# Altium schematic sheet CTRL_LOGIC.SchDoc: CPLD logic
size 420 x 297 mm; Author: G.K.; CompanyName: WUT; DrawnBy: G.K.; Organization: WUT ISE; Address1: Warsaw Univeristy of Technology; Address2: Nowowiejska 15/19; DocumentNumber: 7; Revision: -; SheetNumber: 7; SheetTotal: 7; EDA_Number: ARTIQ; Projet: ARTIQ/SINARA; ModifiedBy: -; CreateDate: XX/XX/XXXX; CheckedDate: -; Title2: & option switches; DivGrp: ISE; Designer: G.K.; ModifiedDate: -; ProjectName: ARTIQ/SINARA
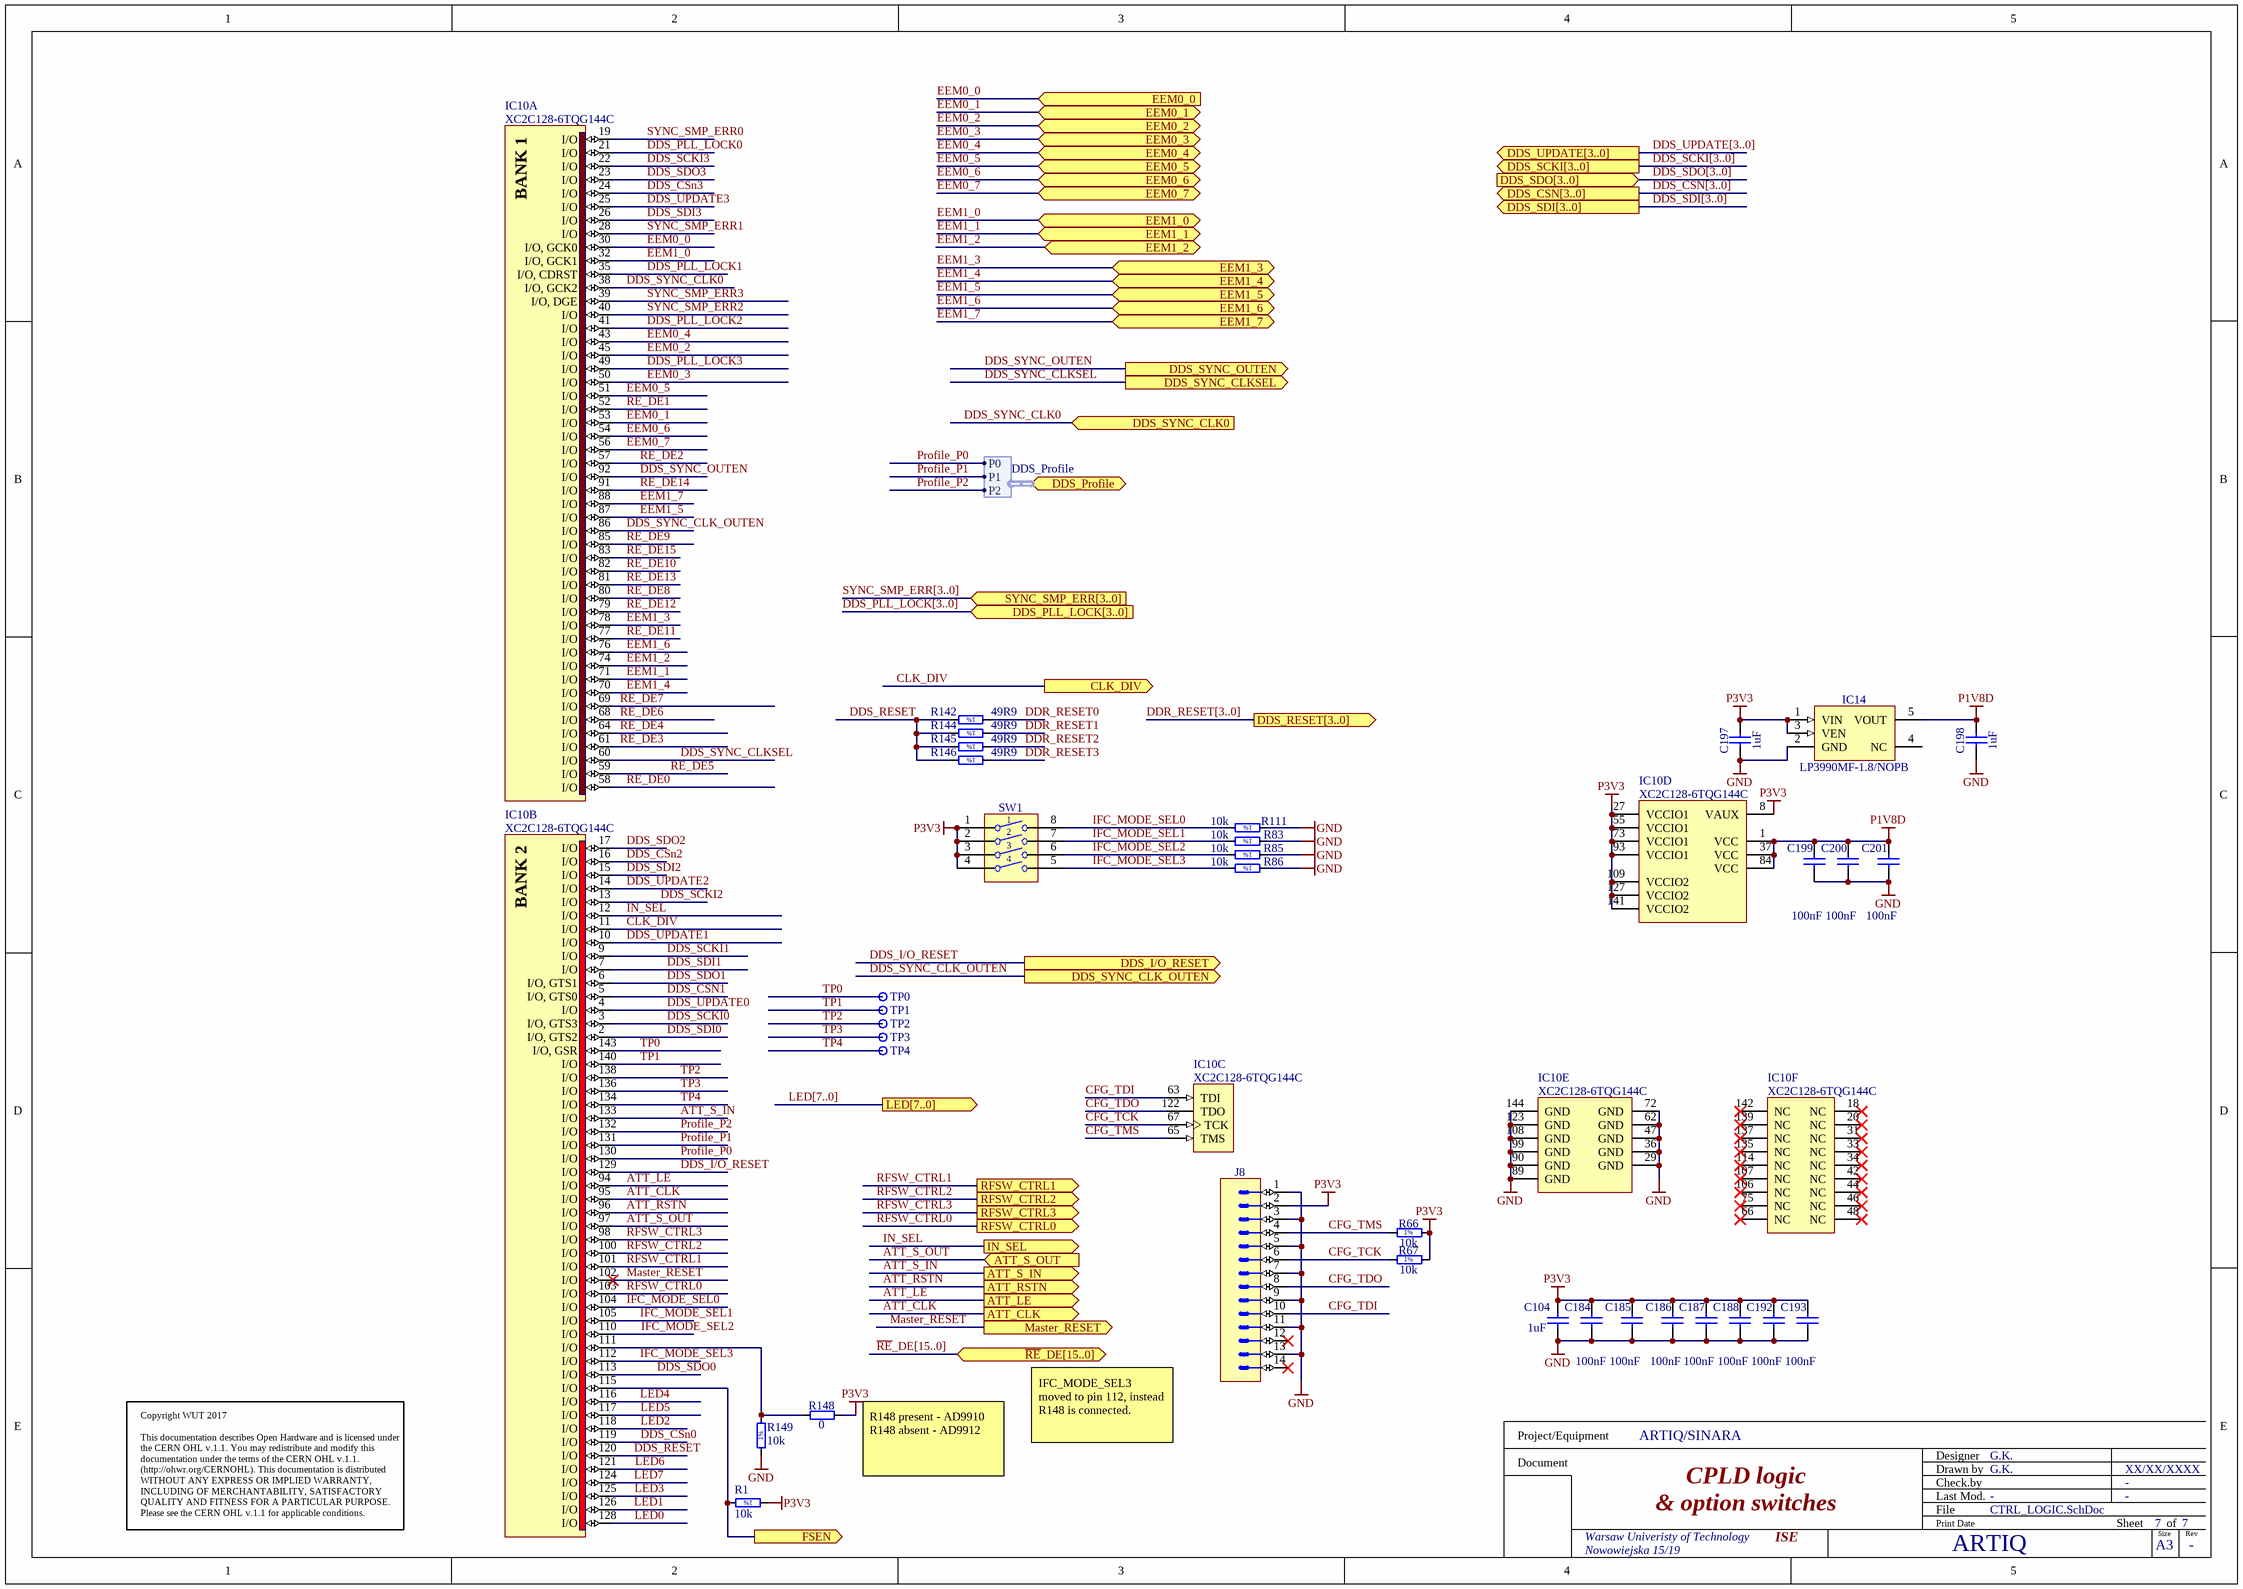
[diagram p0: CTRL_LOGIC.SchDoc]

## Parts
C104  1uF  [CAPC1005X55N]
C184  100nF  [CAPC1005X55N]
C185  100nF  [CAPC1005X55N]
C186  100nF  [CAPC1005X55N]
C187  100nF  [CAPC1005X55N]
C188  100nF  [CAPC1005X55N]
C192  100nF  [CAPC1005X55N]
C193  100nF  [CAPC1005X55N]
C197  1uF  [CAPC1005X55N]
C198  1uF  [CAPC1005X55N]
C199  100nF  [CAPC1005X55N]
C200  100nF  [CAPC1005X55N]
C201  100nF  [CAPC1005X55N]
IC10  XC2C128-6TQG144C  [QFP50P2200X2200X160-144N]  (parts A,B,C,D,E,F of 6)
IC14  LP3990MF-1.8/NOPB  [SOT95P284X122-5N]
J8  Milli-Grid™  [MOLEX_87832-1420]  (value not drawn)
R1  10k  [RESC1005X40N]
R66  10k  [RESC1005X40N]
R67  10k  [RESC1005X40N]
R83  10k  [RESC1005X40N]
R85  10k  [RESC1005X40N]
R86  10k  [RESC1005X40N]
R111  10k  [RESC1005X40N]
R142  49R9  [RESC1005X40N]
R144  49R9  [RESC1005X40N]
R145  49R9  [RESC1005X40N]
R146  49R9  [RESC1005X40N]
R148  0  [RESC1005X40N]
R149  10k  [RESC1005X40N]
SW1  Switch  [SW_OMRON_A6S-4102-H]  (value not drawn)
TP0  Test Point  [TPS127]  (value not drawn)
TP1  Test Point  [TPS127]  (value not drawn)
TP2  Test Point  [TPS127]  (value not drawn)
TP3  Test Point  [TPS127]  (value not drawn)
TP4  Test Point  [TPS127]  (value not drawn)

## Ports
ATT_CLK (out), ATT_LE (out), ATT_RSTN (out), ATT_S_IN (out), ATT_S_OUT (in), CLK_DIV (out), DDS_CSN[3..0] (out), DDS_I/O_RESET (out), DDS_PLL_LOCK[3..0] (in), DDS_Profile (harness DDS_Profile), DDS_RESET[3..0] (out), DDS_SCKI[3..0] (out), DDS_SDI[3..0] (out), DDS_SDO[3..0] (in), DDS_SYNC_CLK0 (in), DDS_SYNC_CLK_OUTEN (out), DDS_SYNC_CLKSEL (out), DDS_SYNC_OUTEN (out), DDS_UPDATE[3..0] (out), EEM0_0 (in), EEM0_1 (bidir), EEM0_2 (bidir), EEM0_3 (bidir), EEM0_4 (bidir), EEM0_5 (bidir), EEM0_6 (bidir), EEM0_7 (bidir), EEM1_0 (bidir), EEM1_1 (bidir), EEM1_2 (bidir), EEM1_3 (bidir), EEM1_4 (bidir), EEM1_5 (bidir), EEM1_6 (bidir), EEM1_7 (bidir), FSEN (out), IN_SEL (out), LED[7..0] (out), Master_RESET (out), RFSW_CTRL0 (out), RFSW_CTRL1 (out), RFSW_CTRL2 (out), RFSW_CTRL3 (out), SYNC_SMP_ERR[3..0] (in), ~{RE}_DE[15..0] (bidir)

## Harnesses
DDS_Profile: P0, P1, P2

## Nets
GND: C104.1 C184.1 C185.1 C186.1 C187.1 C188.1 C192.1 C193.1 C197.1 C198.1 C199.1 C200.1 C201.1 IC10.29(GND) IC10.36(GND) IC10.47(GND) IC10.62(GND) IC10.72(GND) IC10.89(GND) IC10.90(GND) IC10.99(GND) IC10.108(GND) IC10.123(GND) IC10.144(GND) IC14.2(GND) J8.1 J8.3 J8.5 J8.7 J8.9 J8.11 J8.13 R83.1 R85.1 R86.1 R111.1 R149.1
P1V8D: C198.2 C199.2 C200.2 C201.2 IC10.1(VCC) IC10.37(VCC) IC10.84(VCC) IC14.5(VOUT)
P3V3: C104.2 C184.2 C185.2 C186.2 C187.2 C188.2 C192.2 C193.2 C197.2 IC10.8(VAUX) IC10.27(VCCIO1) IC10.55(VCCIO1) IC10.73(VCCIO1) IC10.93(VCCIO1) IC10.109(VCCIO2) IC10.127(VCCIO2) IC10.141(VCCIO2) IC14.1(VIN) IC14.3(VEN) J8.2 R1.1 R66.2 R67.2 R148.2 SW1.1 SW1.2 SW1.3 SW1.4
ATT_CLK: IC10.95(I/O) ; port ATT_CLK
ATT_LE: IC10.94(I/O) ; port ATT_LE
ATT_RSTN: IC10.96(I/O) ; port ATT_RSTN
ATT_S_IN: IC10.133(I/O) ; port ATT_S_IN
ATT_S_OUT: IC10.97(I/O) ; port ATT_S_OUT
CFG_TCK: IC10.67(TCK) J8.6 R67.1
CFG_TDI: IC10.63(TDI) J8.10
CFG_TDO: IC10.122(TDO) J8.8
CFG_TMS: IC10.65(TMS) J8.4 R66.1
CLK_DIV: IC10.11(I/O) ; port CLK_DIV
DDR_RESET0: R142.1
DDR_RESET1: R144.1
DDR_RESET2: R145.1
DDR_RESET3: R146.1
DDS_CSn0: IC10.119(I/O)
DDS_CSN1: IC10.5(I/O,_GTS0)
DDS_CSn2: IC10.16(I/O)
DDS_CSn3: IC10.24(I/O)
DDS_I/O_RESET: IC10.129(I/O) ; port DDS_I/O_RESET
DDS_PLL_LOCK0: IC10.21(I/O)
DDS_PLL_LOCK1: IC10.35(I/O,_CDRST)
DDS_PLL_LOCK2: IC10.41(I/O)
DDS_PLL_LOCK3: IC10.49(I/O)
DDS_RESET: IC10.120(I/O) R142.2 R144.2 R145.2 R146.2
DDS_SCKI0: IC10.3(I/O,_GTS3)
DDS_SCKI1: IC10.9(I/O)
DDS_SCKI2: IC10.13(I/O)
DDS_SCKI3: IC10.22(I/O)
DDS_SDI0: IC10.2(I/O,_GTS2)
DDS_SDI1: IC10.7(I/O)
DDS_SDI2: IC10.15(I/O)
DDS_SDI3: IC10.26(I/O)
DDS_SDO0: IC10.113(I/O)
DDS_SDO1: IC10.6(I/O,_GTS1)
DDS_SDO2: IC10.17(I/O)
DDS_SDO3: IC10.23(I/O)
DDS_SYNC_CLK0: IC10.38(I/O,_GCK2) ; port DDS_SYNC_CLK0
DDS_SYNC_CLK_OUTEN: IC10.86(I/O) ; port DDS_SYNC_CLK_OUTEN
DDS_SYNC_CLKSEL: IC10.60(I/O) ; port DDS_SYNC_CLKSEL
DDS_SYNC_OUTEN: IC10.92(I/O) ; port DDS_SYNC_OUTEN
DDS_UPDATE0: IC10.4(I/O)
DDS_UPDATE1: IC10.10(I/O)
DDS_UPDATE2: IC10.14(I/O)
DDS_UPDATE3: IC10.25(I/O)
EEM0_0: IC10.30(I/O,_GCK0) ; port EEM0_0
EEM0_1: IC10.53(I/O) ; port EEM0_1
EEM0_2: IC10.45(I/O) ; port EEM0_2
EEM0_3: IC10.50(I/O) ; port EEM0_3
EEM0_4: IC10.43(I/O) ; port EEM0_4
EEM0_5: IC10.51(I/O) ; port EEM0_5
EEM0_6: IC10.54(I/O) ; port EEM0_6
EEM0_7: IC10.56(I/O) ; port EEM0_7
EEM1_0: IC10.32(I/O,_GCK1) ; port EEM1_0
EEM1_1: IC10.71(I/O) ; port EEM1_1
EEM1_2: IC10.74(I/O) ; port EEM1_2
EEM1_3: IC10.78(I/O) ; port EEM1_3
EEM1_4: IC10.70(I/O) ; port EEM1_4
EEM1_5: IC10.87(I/O) ; port EEM1_5
EEM1_6: IC10.76(I/O) ; port EEM1_6
EEM1_7: IC10.88(I/O) ; port EEM1_7
FSEN: IC10.115(I/O) R1.2 ; port FSEN
IFC_MODE_SEL0: IC10.104(I/O) R111.2 SW1.8
IFC_MODE_SEL1: IC10.105(I/O) R83.2 SW1.7
IFC_MODE_SEL2: IC10.110(I/O) R85.2 SW1.6
IFC_MODE_SEL3: IC10.112(I/O) R86.2 SW1.5
IN_SEL: IC10.12(I/O) ; port IN_SEL
LED0: IC10.128(I/O)
LED1: IC10.126(I/O)
LED2: IC10.118(I/O)
LED3: IC10.125(I/O)
LED4: IC10.116(I/O)
LED5: IC10.117(I/O)
LED6: IC10.121(I/O)
LED7: IC10.124(I/O)
Master_RESET: IC10.102(I/O) ; port Master_RESET
Profile_P0: IC10.130(I/O) ; port DDS_Profile.P0
Profile_P1: IC10.131(I/O) ; port DDS_Profile.P1
Profile_P2: IC10.132(I/O) ; port DDS_Profile.P2
~{RE}_DE0: IC10.58(I/O)
~{RE}_DE1: IC10.52(I/O)
~{RE}_DE2: IC10.57(I/O)
~{RE}_DE3: IC10.61(I/O)
~{RE}_DE4: IC10.64(I/O)
~{RE}_DE5: IC10.59(I/O)
~{RE}_DE6: IC10.68(I/O)
~{RE}_DE7: IC10.69(I/O)
~{RE}_DE8: IC10.80(I/O)
~{RE}_DE9: IC10.85(I/O)
~{RE}_DE10: IC10.82(I/O)
~{RE}_DE11: IC10.77(I/O)
~{RE}_DE12: IC10.79(I/O)
~{RE}_DE13: IC10.81(I/O)
~{RE}_DE14: IC10.91(I/O)
~{RE}_DE15: IC10.83(I/O)
RFSW_CTRL0: IC10.103(I/O) ; port RFSW_CTRL0
RFSW_CTRL1: IC10.101(I/O) ; port RFSW_CTRL1
RFSW_CTRL2: IC10.100(I/O) ; port RFSW_CTRL2
RFSW_CTRL3: IC10.98(I/O) ; port RFSW_CTRL3
SYNC_SMP_ERR0: IC10.19(I/O)
SYNC_SMP_ERR1: IC10.28(I/O)
SYNC_SMP_ERR2: IC10.40(I/O)
SYNC_SMP_ERR3: IC10.39(I/O,_DGE)
TP0: IC10.143(I/O,_GSR) TP0.1
TP1: IC10.140(I/O) TP1.1
TP2: IC10.138(I/O) TP2.1
TP3: IC10.136(I/O) TP3.1
TP4: IC10.134(I/O) TP4.1
NetIC10_111: IC10.111(I/O) R148.1 R149.2

Not connected (* = marked no-connect by the designer): IC10 18(NC)* 20(NC)* 31(NC)* 33(NC)* 34(NC)* 42(NC)* 44(NC)* 46(NC)* 48(NC)* 66(NC)* 75(NC)* 106(NC)* 107(NC)* 114(NC)* 135(NC)* 137(NC)* 139(NC)* 142(NC)*; IC14 4(NC); J8 12* 14*

## Buses and harness runs
bus DDR_RESET[3..0] = port DDS_RESET[3..0]
bus DDS_CSN[3..0] = port DDS_CSN[3..0]
bus DDS_PLL_LOCK[3..0] = port DDS_PLL_LOCK[3..0]
bus DDS_SCKI[3..0] = port DDS_SCKI[3..0]
bus DDS_SDI[3..0] = port DDS_SDI[3..0]
bus DDS_SDO[3..0] = port DDS_SDO[3..0]
bus DDS_UPDATE[3..0] = port DDS_UPDATE[3..0]
bus LED[7..0] = port LED[7..0]
bus SYNC_SMP_ERR[3..0] = port SYNC_SMP_ERR[3..0]
bus ~{RE}_DE[15..0] = port ~{RE}_DE[15..0]

## Notes on the sheet
- (near R148) R148 present - AD9910
  R148 absent - AD9912
- IFC_MODE_SEL3 moved to pin 112, instead R148 is connected.
- Copyright WUT 2017
  This documentation describes Open Hardware and is licensed under the CERN OHL v.1.1. You may redistribute and modify this documentation under the terms of the CERN OHL v.1.1. (http://ohwr.org/CERNOHL). This documentation is distributed WITHOUT ANY EXPRESS OR IMPLIED WARRANTY, INCLUDING OF MERCHANTABILITY, SATISFACTORY QUALITY AND FITNESS FOR A PARTICULAR PURPOSE. Please see the CERN OHL v.1.1 for applicable conditions.
- Project/Equipment
- Document
- Designer
- Drawn by
- Check.by
- File
- Last Mod.
- Print Date
- Sheet
- Size
- A3
- of
- Rev
- (in symbol R0402_10K_1%_0.0625W_100PPM) 1%
- (in symbol R0402_49R9_1%_0.0625W_100PPM) 1%
- (in symbol XC2C128-6TQG144C, part A) BANK 1
- (in symbol XC2C128-6TQG144C, part B) BANK 2

## Library data of the parts
C104 C197 C198 = CC0402_1UF_16V_10%_X5R: Non-polarised capacitor; Part Description: SMD Multilayer Chip Ceramic Capacitor; Manufacturer: GENERIC; Manufacturer1 Part Number: C1005X5R1C105KT; Voltage: 16V; TC: X5R; Tolerance: ±10%; Part Number: CC0402_1UF_16V_10%_X5R; Component Kind: Standard; Component Type: Standard; Pin Count: 2; Value: 1uF; Status: Preferred; Manufacturer Part Number: CC0402_1UF_16V_10%_X5R; Case: 0402; Mounted: Yes; Socket: No; SMD: Yes; Sense: No; Manufacturer1 Example: TDK; Manufacturer1 ComponentHeight: 0.55mm; HelpURL: \\cern.ch\dfs\Applications\Altium\Datasheets\CC0402_X5R_TDK_C.pdf; Author: CERN DEM JLC; CreateDate: 2012-10-25; LatestRevisionDate: 2012-10-25
C184-C188 C192 C193 C199-C201 = CC0402_100NF_16V_10%_X5R: Non-polarised capacitor; Part Description: SMD Multilayer Chip Ceramic Capacitor; Manufacturer: GENERIC; Manufacturer1 Part Number: GRM155R61C104KA88D; Voltage: 16V; TC: X5R; Tolerance: ±10%; Part Number: CC0402_100NF_16V_10%_X5R; Component Kind: Standard; Component Type: Standard; Pin Count: 2; Value: 100nF; Status: None; Manufacturer Part Number: CC0402_100NF_16V_10%_X5R; Case: 0402; Mounted: Yes; Socket: No; SMD: Yes; Sense: No; Manufacturer1 Example: MURATA; Manufacturer1 ComponentHeight: 0.55mm; HelpURL: \\cern.ch\dfs\Applications\Altium\Datasheets\CC0402_X5R_MURATA_GRM.pdf; Author: CERN DEM JLC; CreateDate: 10.12.2013; LatestRevisionDate: 10.12.2013
IC10 = XC2C128-6TQG144C: CoolRunner-II 1.8V, 128 Macrocell CPLD, 100 User I/Os, 144-Pin TQFP, Commercial Grade, Pb-Free; Manufacturer: XILINX; PressFit: No; Bonding: No; Part Number: XC2C128-6TQG144C; Component Kind: Standard; Component Type: Standard; Device: XC2C128-6TQG144C; PackageDescription: QFP, 144-Leads, Body 20x20mm (BSC), Pitch 0.50mm, IPC Medium Density; Part Description: CoolRunner-II 1.8V, 128 Macrocell CPLD, 100 User I/Os, 144-Pin TQFP, Commercial Grade, Pb-Free; Manufacturer Part Number: XC2C128-6TQG144C; Pin Count: 144; Case: QFP144; Mounted: Yes; Socket: No; SMD: Yes; Sense: No; ComponentHeight: 1.6mm; HelpURL: \\cern.ch\dfs\Applications\Altium\Datasheets\XC2C128-6TQG144C.pdf; ComponentLink1URL: \\cern.ch\dfs\Applications\Altium\Datasheets\XC2C128-6TQG144C_Package.pdf; ComponentLink1Description: Package Drawing; Author: CERN DEM JLC; CreateDate: 16.11.2010; LatestRevisionDate: 16.11.2010
IC14 = LP3990MF-1.8/NOPB: 1.8V, 150mA Linear Voltage Regulator For Digital Applications; Manufacturer: TEXAS INSTRUMENTS; PressFit: No; Bonding: No; Part Number: LP3990MF-1.8/NOPB; Component Kind: Standard; Component Type: Standard; Device: LP3990MF-1.8/NOPB; PackageDescription: SOT23 5, Pitch 0.95mm - Body 1.67x2.99mm, IPC Medium Density; Part Description: 1.8V, 150mA Linear Voltage Regulator For Digital Applications; Manufacturer Part Number: LP3990MF-1.8/NOPB; Pin Count: 5; Case: SOT23-5; Mounted: Yes; Socket: No; SMD: Yes; Sense: No; ComponentHeight: 1.19mm; HelpURL: \\cern.ch\dfs\Applications\Altium\Datasheets\LP3990MF-1.8-NOPB.pdf; Author: CERN DEM JLC; CreateDate: 19.01.2011; LatestRevisionDate: 16.09.2014
J8 = MOLEX_87832-1420: Connector 14 Male; Part Description: 2.00mm (.079") Pitch Milli-Grid™ Header, Surface Mount, Vertical, Shrouded, 14 Circuits,with Locking Windows and Centre Polarization Slot, PCB Locator; Manufacturer: MOLEX; PressFit: No; Part Number: MOLEX_87832-1420; Component Kind: Standard; Component Type: Standard; Pin Count: 14; Family: Milli-Grid™; Mounted: Yes; Socket: No; SMD: Yes; Sense: No; Status: None; Manufacturer Part Number: 87832-1420; ComponentHeight: 7.6mm; HelpURL: \\cern.ch\dfs\Applications\Altium\Datasheets\MOLEX_87832-1420.pdf; Author: CERN DEM JLC; CreateDate: 09.09.2008; LatestRevisionDate: 09.09.2008
R1 R66 R67 R83 R85 R86 R111 R149 = R0402_10K_1%_0.0625W_100PPM: Resistor - 1%; Part Description: General Purpose Thick Film Chip Resistor; Manufacturer: GENERIC; Manufacturer1 Part Number: 232270671003L; TC: ±100ppm/°C; Part Number: R0402_10K_1%_0.0625W_100PPM; Component Kind: Standard; Component Type: Standard; Pin Count: 2; Value: 10k; Status: Not recommended; Power: 0.0625W; Tolerance: ±1%; Manufacturer Part Number: R0402_10K_1%_0.0625W_100PPM; Case: 0402; Mounted: Yes; Sense: No; Socket: No; SMD: Yes; Manufacturer1 Example: YAGEO PHYCOMP; Manufacturer1 ComponentHeight: 0.4mm; HelpURL: \\cern.ch\dfs\Applications\Altium\Datasheets\R0402_Phycomp_RC0402.pdf; Author: CERN DEM JLC; CreateDate: 03.12.2007; LatestRevisionDate: 17.10.2012
R142 R144-R146 = R0402_49R9_1%_0.0625W_100PPM: Resistor - 1%; Part Description: General Purpose Thick Film Chip Resistor; Manufacturer: GENERIC; Manufacturer1 Part Number: 232270674999L or RC0402FR-0749R9L; TC: ±100ppm/°C; PressFit: No; Part Number: R0402_49R9_1%_0.0625W_100PPM; Component Kind: Standard; Component Type: Standard; Pin Count: 2; Value: 49R9; Status: Not Recommended; Power: 0.0625W; Tolerance: ±1%; Manufacturer Part Number: R0402_49R9_1%_0.0625W_100PPM; Case: 0402; Mounted: Yes; Sense: No; Socket: No; SMD: Yes; Manufacturer1 Example: YAGEO PHYCOMP; Manufacturer1 ComponentHeight: 0.4mm; HelpURL: \\cern.ch\dfs\Applications\Altium\Datasheets\R0402_Phycomp_RC0402.pdf; Author: CERN DEM JLC; CreateDate: 24.10.2012; LatestRevisionDate: 24.10.2012
R148 = R0402_0R_JUMPER: Resistor; Part Description: 1A (0.05R Max DC Resistance) Zero Ohm Jumper; Manufacturer: GENERIC; Manufacturer1 Part Number: 232270591001L; Part Number: R0402_0R_JUMPER; Component Kind: Standard; Component Type: Standard; Pin Count: 2; Value: 0; Status: Not recommended; Manufacturer Part Number: R0402_0R_JUMPER; Case: 0402; Mounted: Yes; Sense: No; Socket: No; SMD: Yes; Manufacturer1 Example: YAGEO PHYCOMP; Manufacturer1 ComponentHeight: 0.4mm; HelpURL: \\cern.ch\dfs\Applications\Altium\Datasheets\R0402_Phycomp_RC0402.pdf; Author: CERN DEM JLC; CreateDate: 2007-12-03; LatestRevisionDate: 2012-10-17
SW1 = SW_OMRON_A6S-4102-H: 4 Ways SPST DIP Switch; Part Description: 4 Ways SPST DIP Switch, White Flat Actuator with Seal Tape, Contact Rating 25mA 24VDC; Manufacturer: OMRON; PressFit: No; Part Number: SW_OMRON_A6S-4102-H; Component Kind: Standard; Component Type: Standard; Pin Count: 8; PackageDescription: Pitch 2.54mm, Body 11.3x6.4mm, 4 Ways SPST Surface-Mounting DIP Switch, OMRON A6S-H; Family: Switch; Mounted: Yes; Socket: No; SMD: Yes; Sense: No; Status: None; Manufacturer Part Number: A6S-4102-H; ComponentHeight: 3.8mm; HelpURL: \\cern.ch\dfs\Applications\Altium\Datasheets\SW_OMRON_A6S-4102-H.pdf; Author: CERN DEM JMW; CreateDate: 25.09.2008; LatestRevisionDate: 25.09.2008
TP0-TP4 = SMD_PAD_1.27X1.27MM: Part Description: 1.27mm x 1.27mm PCB Copper Area (SMD Test Point); Mounted: No; Part Number: SMD_PAD_1.27X1.27MM; Component Kind: Standard (No BOM); Component Type: Standard (No BOM); Pin Count: 1; Family: Test Point; Socket: No; SMD: Yes; Sense: No; Status: None; ComponentHeight: 0mm; HelpURL: Undefined; Author: CERN DEM JLC; CreateDate: 12.01.2008; LatestRevisionDate: 12.01.2008; PackageDescription: 1.27mm x 1.27mm PCB Copper Area (SMD Test Point)